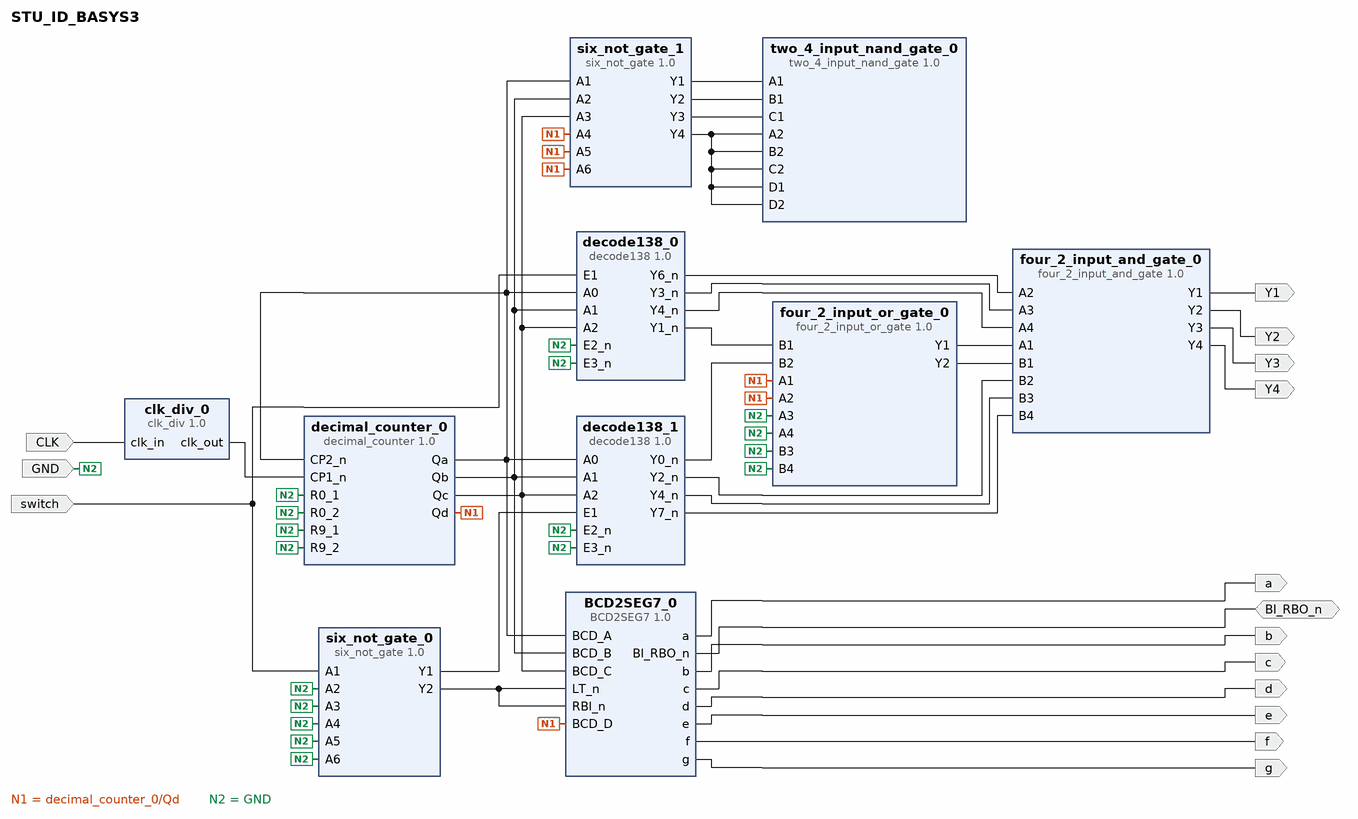
[diagram p0: block diagram of the top level]
# Vivado block design STU_ID_BASYS3, Vivado 2015.3
create_bd_design STU_ID_BASYS3

create_bd_port -dir I CLK
create_bd_port -dir I GND
create_bd_port -dir I switch
create_bd_port -dir O Y1
create_bd_port -dir O Y2
create_bd_port -dir O Y3
create_bd_port -dir O Y4
create_bd_port -dir O a
create_bd_port -dir O b
create_bd_port -dir O c
create_bd_port -dir O d
create_bd_port -dir O e
create_bd_port -dir O f
create_bd_port -dir O g
create_bd_port -dir IO BI_RBO_n

create_bd_cell -type ip -vlnv xilinx.com:XUP:decode138:1.0 decode138_0
create_bd_cell -type ip -vlnv xilinx.com:xup:BCD2SEG7:1.0 BCD2SEG7_0
create_bd_cell -type ip -vlnv xilinx.com:xup:clk_div:1.0 clk_div_0
set_property -dict {CONFIG.N 99999} [get_bd_cells clk_div_0]
create_bd_cell -type ip -vlnv xilinx.com:xup:decimal_counter:1.0 decimal_counter_0
create_bd_cell -type ip -vlnv xilinx.com:XUP:decode138:1.0 decode138_1
create_bd_cell -type ip -vlnv xilinx.com:XUP:six_not_gate:1.0 six_not_gate_0
create_bd_cell -type ip -vlnv xilinx.com:XUP:four_2_input_or_gate:1.0 four_2_input_or_gate_0
create_bd_cell -type ip -vlnv xilinx.com:XUP:four_2_input_and_gate:1.0 four_2_input_and_gate_0
create_bd_cell -type ip -vlnv xilinx.com:XUP:six_not_gate:1.0 six_not_gate_1
create_bd_cell -type ip -vlnv xilinx.com:XUP:two_4_input_nand_gate:1.0 two_4_input_nand_gate_0

# ---- connections ----

connect_bd_net -net clk_in_1 [get_bd_ports CLK] [get_bd_pins clk_div_0/clk_in]
connect_bd_net [get_bd_pins clk_div_0/clk_out] [get_bd_pins decimal_counter_0/CP1_n]
connect_bd_net -net E1_1 [get_bd_ports switch] [get_bd_pins decode138_0/E1] [get_bd_pins six_not_gate_0/A1]
connect_bd_net [get_bd_pins six_not_gate_0/Y1] [get_bd_pins decode138_1/E1]
connect_bd_net [get_bd_pins decode138_0/Y1_n] [get_bd_pins four_2_input_or_gate_0/B1]
connect_bd_net [get_bd_pins four_2_input_or_gate_0/Y1] [get_bd_pins four_2_input_and_gate_0/A1]
connect_bd_net [get_bd_pins decode138_0/Y6_n] [get_bd_pins four_2_input_and_gate_0/A2]
connect_bd_net [get_bd_pins decode138_0/Y3_n] [get_bd_pins four_2_input_and_gate_0/A3]
connect_bd_net [get_bd_pins decode138_0/Y4_n] [get_bd_pins four_2_input_and_gate_0/A4]
connect_bd_net [get_bd_pins decode138_1/Y2_n] [get_bd_pins four_2_input_and_gate_0/B2]
connect_bd_net [get_bd_pins decode138_1/Y4_n] [get_bd_pins four_2_input_and_gate_0/B3]
connect_bd_net [get_bd_pins BCD2SEG7_0/BI_RBO_n] [get_bd_ports BI_RBO_n]
connect_bd_net [get_bd_pins six_not_gate_0/Y2] [get_bd_pins BCD2SEG7_0/LT_n] [get_bd_pins BCD2SEG7_0/RBI_n]
connect_bd_net [get_bd_pins BCD2SEG7_0/a] [get_bd_ports a]
connect_bd_net [get_bd_pins BCD2SEG7_0/b] [get_bd_ports b]
connect_bd_net [get_bd_pins BCD2SEG7_0/c] [get_bd_ports c]
connect_bd_net [get_bd_pins BCD2SEG7_0/d] [get_bd_ports d]
connect_bd_net [get_bd_pins BCD2SEG7_0/e] [get_bd_ports e]
connect_bd_net [get_bd_pins BCD2SEG7_0/f] [get_bd_ports f]
connect_bd_net [get_bd_pins BCD2SEG7_0/g] [get_bd_ports g]
connect_bd_net [get_bd_pins four_2_input_and_gate_0/Y1] [get_bd_ports Y1]
connect_bd_net [get_bd_pins four_2_input_and_gate_0/Y2] [get_bd_ports Y2]
connect_bd_net [get_bd_pins four_2_input_and_gate_0/Y3] [get_bd_ports Y3]
connect_bd_net [get_bd_pins four_2_input_and_gate_0/Y4] [get_bd_ports Y4]
connect_bd_net [get_bd_pins decimal_counter_0/Qa] \
  [get_bd_pins decimal_counter_0/CP2_n] [get_bd_pins BCD2SEG7_0/BCD_A] [get_bd_pins decode138_0/A0] \
  [get_bd_pins decode138_1/A0] [get_bd_pins six_not_gate_1/A1]
connect_bd_net [get_bd_pins decimal_counter_0/Qb] \
  [get_bd_pins BCD2SEG7_0/BCD_B] [get_bd_pins decode138_0/A1] [get_bd_pins decode138_1/A1] [get_bd_pins six_not_gate_1/A2]
connect_bd_net [get_bd_pins decimal_counter_0/Qc] \
  [get_bd_pins BCD2SEG7_0/BCD_C] [get_bd_pins decode138_0/A2] [get_bd_pins decode138_1/A2] [get_bd_pins six_not_gate_1/A3]
connect_bd_net [get_bd_pins decimal_counter_0/Qd] \
  [get_bd_pins BCD2SEG7_0/BCD_D] [get_bd_pins four_2_input_or_gate_0/A1] [get_bd_pins four_2_input_or_gate_0/A2] \
  [get_bd_pins six_not_gate_1/A4] [get_bd_pins six_not_gate_1/A5] [get_bd_pins six_not_gate_1/A6]
connect_bd_net [get_bd_pins decode138_1/Y0_n] [get_bd_pins four_2_input_or_gate_0/B2]
connect_bd_net [get_bd_pins six_not_gate_1/Y1] [get_bd_pins two_4_input_nand_gate_0/A1]
connect_bd_net [get_bd_pins six_not_gate_1/Y2] [get_bd_pins two_4_input_nand_gate_0/B1]
connect_bd_net [get_bd_pins six_not_gate_1/Y3] [get_bd_pins two_4_input_nand_gate_0/C1]
connect_bd_net [get_bd_pins six_not_gate_1/Y4] \
  [get_bd_pins two_4_input_nand_gate_0/D1] [get_bd_pins two_4_input_nand_gate_0/A2] [get_bd_pins two_4_input_nand_gate_0/B2] \
  [get_bd_pins two_4_input_nand_gate_0/C2] [get_bd_pins two_4_input_nand_gate_0/D2]
connect_bd_net [get_bd_pins four_2_input_or_gate_0/Y2] [get_bd_pins four_2_input_and_gate_0/B1]
connect_bd_net [get_bd_pins decode138_1/Y7_n] [get_bd_pins four_2_input_and_gate_0/B4]
connect_bd_net [get_bd_ports GND] \
  [get_bd_pins six_not_gate_0/A2] [get_bd_pins six_not_gate_0/A3] [get_bd_pins six_not_gate_0/A4] \
  [get_bd_pins six_not_gate_0/A5] [get_bd_pins six_not_gate_0/A6] [get_bd_pins decimal_counter_0/R0_1] \
  [get_bd_pins decimal_counter_0/R0_2] [get_bd_pins decimal_counter_0/R9_1] [get_bd_pins decimal_counter_0/R9_2] \
  [get_bd_pins decode138_0/E2_n] [get_bd_pins decode138_0/E3_n] [get_bd_pins decode138_1/E2_n] [get_bd_pins decode138_1/E3_n] \
  [get_bd_pins four_2_input_or_gate_0/A3] [get_bd_pins four_2_input_or_gate_0/B3] [get_bd_pins four_2_input_or_gate_0/A4] \
  [get_bd_pins four_2_input_or_gate_0/B4]

validate_bd_design
save_bd_design
